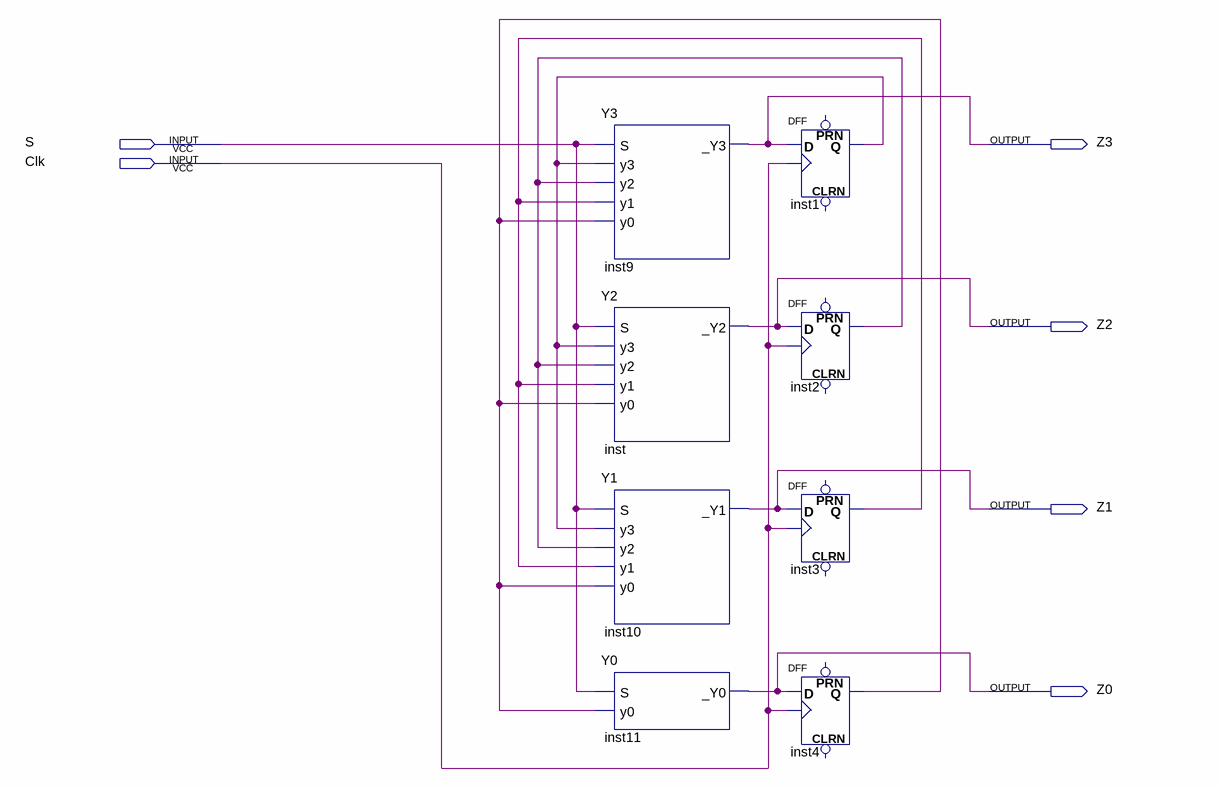
[diagram p0: schematic sheet]
// Quartus schematic state_machine.bdf as structural Verilog: 8 symbols, 6 pins
module state_machine (
  input  S,
  input  Clk,
  output Z3,
  output Z2,
  output Z1,
  output Z0
);

  wire inst1_q, inst2_q, inst3_q, inst4_q;

  Y3 inst9 (.S(S), .y3(inst1_q), .y2(inst2_q), .y1(inst3_q), .y0(inst4_q), ._Y3(Z3));
  Y2 inst (.S(S), .y3(inst1_q), .y2(inst2_q), .y1(inst3_q), .y0(inst4_q), ._Y2(Z2));
  Y1 inst10 (.S(S), .y3(inst1_q), .y2(inst2_q), .y1(inst3_q), .y0(inst4_q), ._Y1(Z1));
  Y0 inst11 (.S(S), .y0(inst4_q), ._Y0(Z0));
  DFF inst1 (.CLK(Clk), .D(Z3), .Q(inst1_q));  // open: CLRN, PRN
  DFF inst2 (.CLK(Clk), .D(Z2), .Q(inst2_q));  // open: CLRN, PRN
  DFF inst3 (.CLK(Clk), .D(Z1), .Q(inst3_q));  // open: CLRN, PRN
  DFF inst4 (.CLK(Clk), .D(Z0), .Q(inst4_q));  // open: CLRN, PRN
endmodule
